# EAGLE schematic untitled (EAGLE 9.6.2)
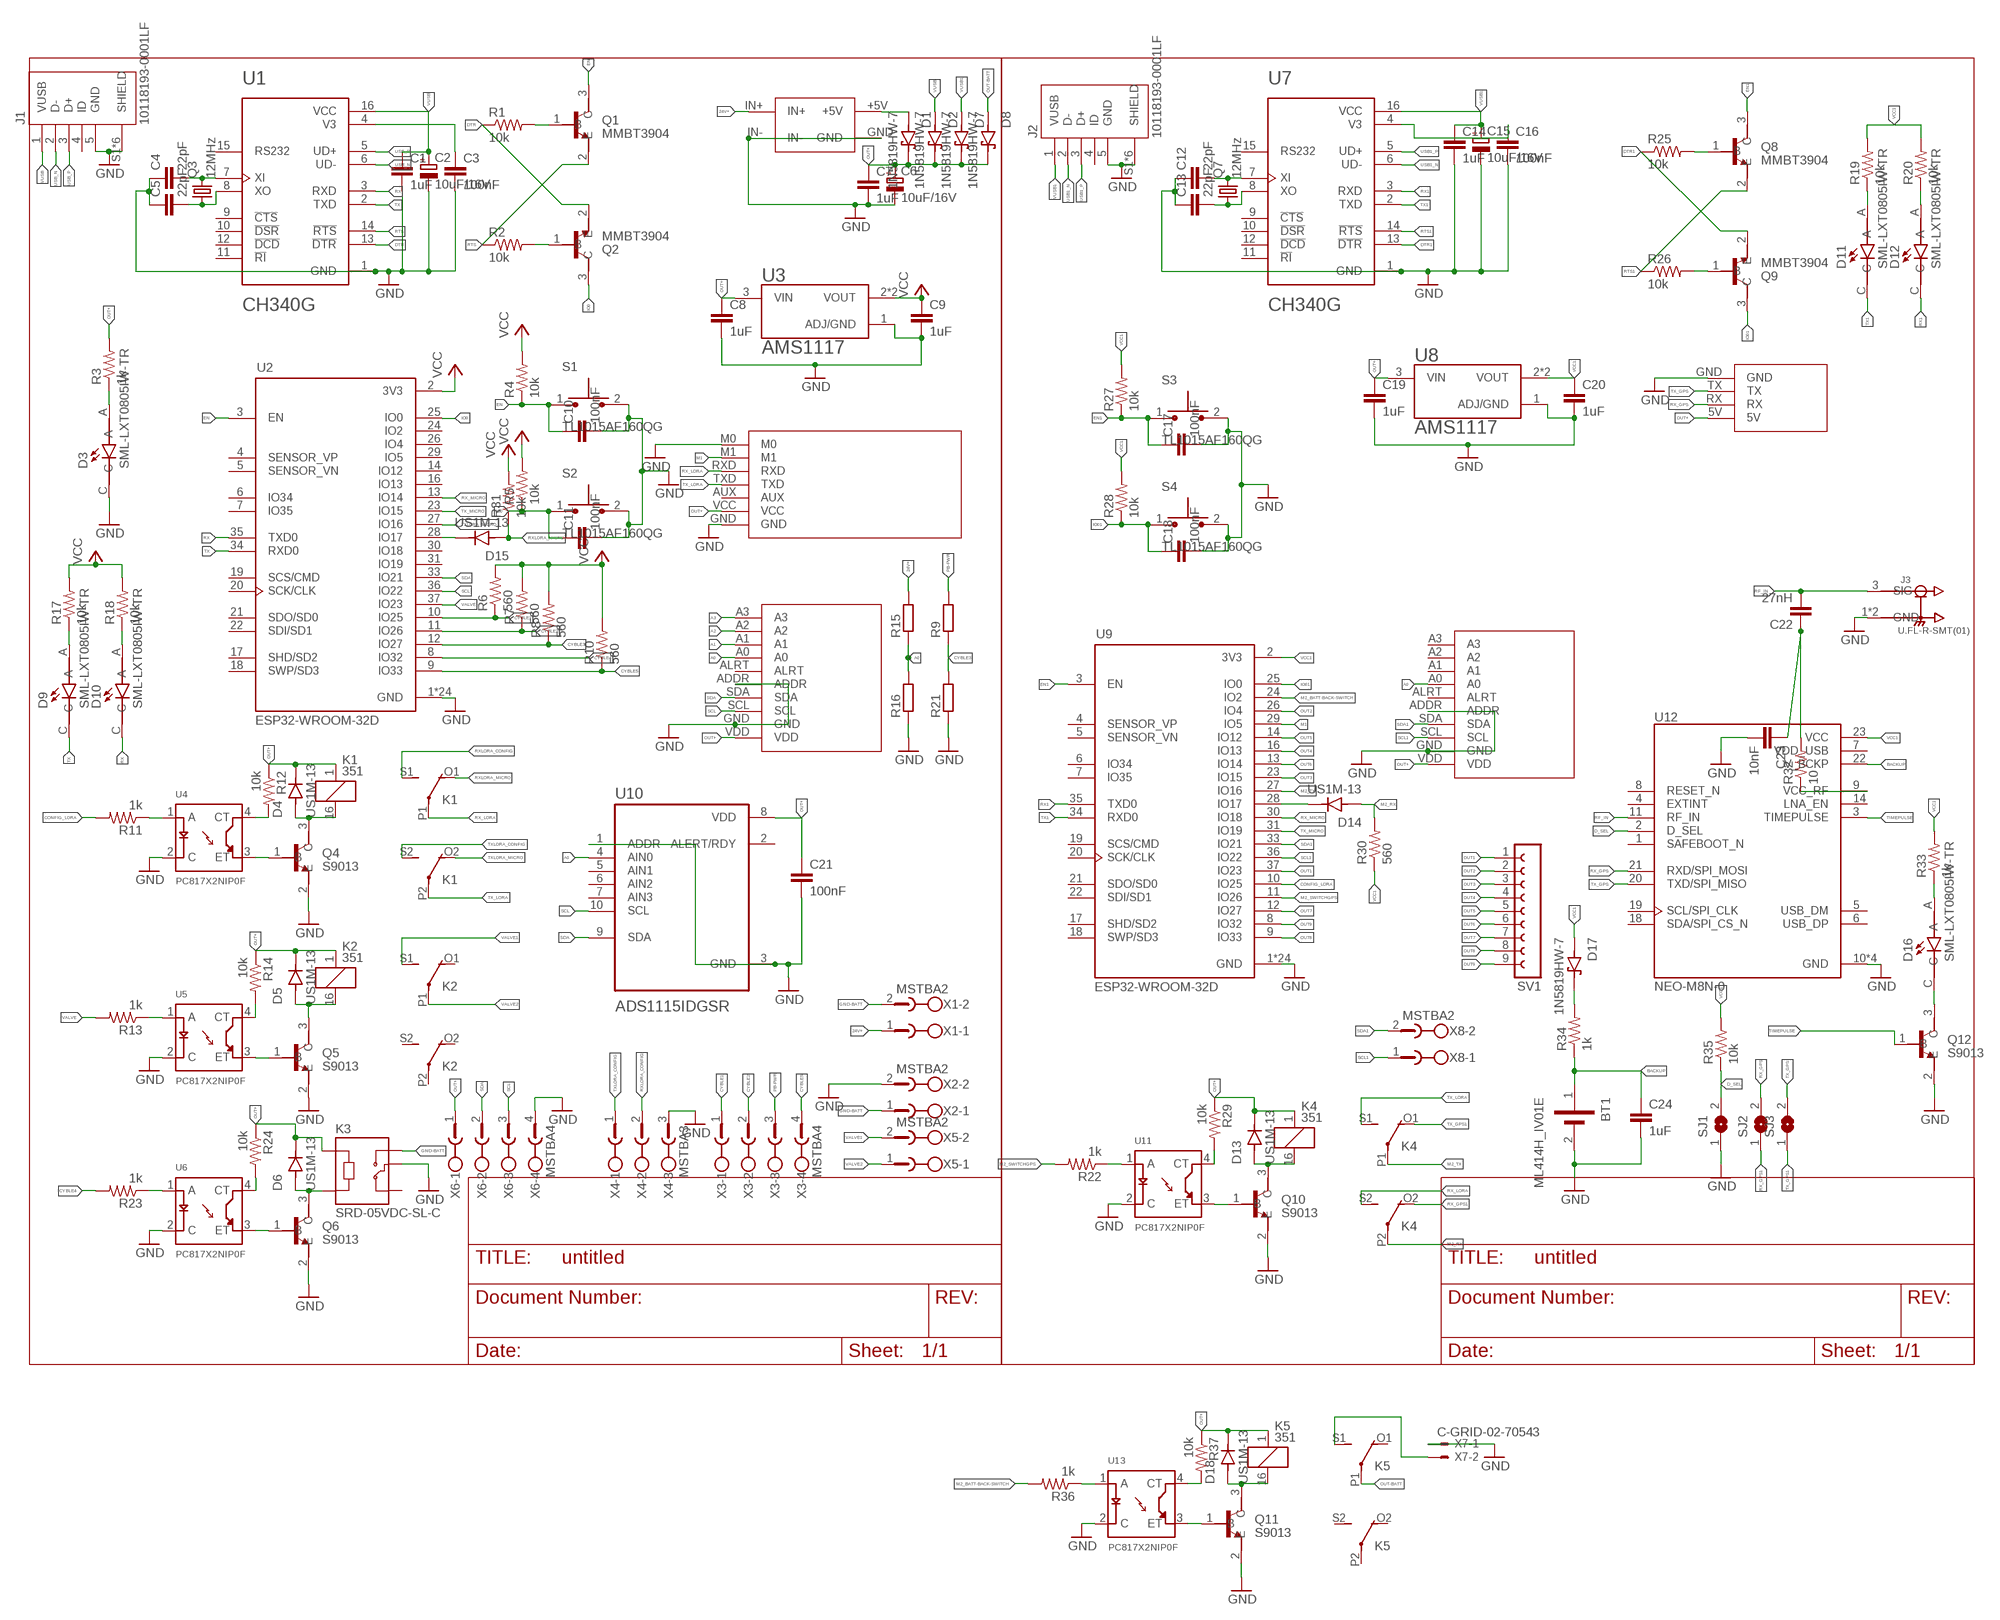
[diagram p0: schematic, sheet 1]

## Parts
ADS1  ADS1115  [ADS1115]
ADS2  ADS1115  [ADS1115]
BT1  ML414H_IV01E  [SEIKO_ML414H_IV01E]
C1  1uF  C-EUC0805K  [C0805K]
C2  10uF/16V  CPOL-EU153CLV-0505  [153CLV-0505]
C3  100nF  C-EUC0805K  [C0805K]
C4  22pF  C-EUC0805K  [C0805K]
C5  22pF  C-EUC0805K  [C0805K]
C6  10uF/16V  CPOL-EU153CLV-0505  [153CLV-0505]
C7  1uF  C-EUC0805K  [C0805K]
C8  1uF  C-EUC0805K  [C0805K]
C9  1uF  C-EUC0805K  [C0805K]
C10  100nF  C-EUC0805K  [C0805K]
C11  100nF  C-EUC0805K  [C0805K]
C12  22pF  C-EUC0805K  [C0805K]
C13  22pF  C-EUC0805K  [C0805K]
C14  1uF  C-EUC0805K  [C0805K]
C15  10uF/16V  CPOL-EU153CLV-0505  [153CLV-0505]
C16  100nF  C-EUC0805K  [C0805K]
C17  100nF  C-EUC0805K  [C0805K]
C18  100nF  C-EUC0805K  [C0805K]
C19  1uF  C-EUC0805K  [C0805K]
C20  1uF  C-EUC0805K  [C0805K]
C21  100nF  C-EUC0805K  [C0805K]
C22  27nH  C-EUC0805K  [C0805K]
C23  10nF  C-EUC0805K  [C0805K]
C24  1uF  C-EUC0805K  [C0805K]
D1  1N5819HW-7  [SOD3715X145N]
D2  1N5819HW-7  [SOD3715X145N]
D3  SML-LXT0805IW-TR  [LEDC2012X120N]
D4  US1M-13  [DIOM5226X240N]
D5  US1M-13  [DIOM5226X240N]
D6  US1M-13  [DIOM5226X240N]
D7  1N5819HW-7  [SOD3715X145N]
D8  1N5819HW-7  [SOD3715X145N]
D9  SML-LXT0805IW-TR  [LEDC2012X120N]
D10  SML-LXT0805IW-TR  [LEDC2012X120N]
D11  SML-LXT0805IW-TR  [LEDC2012X120N]
D12  SML-LXT0805IW-TR  [LEDC2012X120N]
D13  US1M-13  [DIOM5226X240N]
D14  US1M-13  [DIOM5226X240N]
D15  US1M-13  [DIOM5226X240N]
D16  SML-LXT0805IW-TR  [LEDC2012X120N]
D17  1N5819HW-7  [SOD3715X145N]
D18  US1M-13  [DIOM5226X240N]
EBYTEE220-900T22D1  EBYTEE220-900T22D  [EBYTEE220-900T22D]
J1  10118193-0001LF  [FCI_10118193-0001LF]
J2  10118193-0001LF  [FCI_10118193-0001LF]
J3  U.FL-R-SMT(01)  [HRS_U.FL-R-SMT(01)]
K1  351  [351]
K2  351  [351]
K3  SRD-05VDC-SL-C  [RELAY_SRD-05VDC-SL-C]
K4  351  [351]
K5  351  [351]
NEO-6MGPS1  NEO-6MGPS  [NEO-6MGPS]
Q1  MMBT3904  [SOT95P240X120-3N]
Q2  MMBT3904  [SOT95P240X120-3N]
Q3  12MHz  CRYSTALSM49  [SM49]
Q4  S9013  [SOT95P240X120-3N]
Q5  S9013  [SOT95P240X120-3N]
Q6  S9013  [SOT95P240X120-3N]
Q7  12MHz  CRYSTALSM49  [SM49]
Q8  MMBT3904  [SOT95P240X120-3N]
Q9  MMBT3904  [SOT95P240X120-3N]
Q10  S9013  [SOT95P240X120-3N]
Q11  S9013  [SOT95P240X120-3N]
Q12  S9013  [SOT95P240X120-3N]
R1  10k  R-US_M0805  [M0805]
R2  10k  R-US_M0805  [M0805]
R3  1k  R-US_M0805  [M0805]
R4  10k  R-US_M0805  [M0805]
R5  10k  R-US_M0805  [M0805]
R6  560  R-US_M0805  [M0805]
R7  560  R-US_M0805  [M0805]
R8  560  R-US_M0805  [M0805]
R9  R-EU_0207/12  [0207/12]
R10  560  R-US_M0805  [M0805]
R11  1k  R-US_M0805  [M0805]
R12  10k  R-US_M0805  [M0805]
R13  1k  R-US_M0805  [M0805]
R14  10k  R-US_M0805  [M0805]
R15  R-EU_0207/12  [0207/12]
R16  R-EU_0207/12  [0207/12]
R17  10k  R-US_M0805  [M0805]
R18  10k  R-US_M0805  [M0805]
R19  10k  R-US_M0805  [M0805]
R20  10k  R-US_M0805  [M0805]
R21  R-EU_0207/12  [0207/12]
R22  1k  R-US_M0805  [M0805]
R23  1k  R-US_M0805  [M0805]
R24  10k  R-US_M0805  [M0805]
R25  10k  R-US_M0805  [M0805]
R26  10k  R-US_M0805  [M0805]
R27  10k  R-US_M0805  [M0805]
R28  10k  R-US_M0805  [M0805]
R29  10k  R-US_M0805  [M0805]
R30  560  R-US_M0805  [M0805]
R31  10k  R-US_M0805  [M0805]
R32  10  R-US_M0805  [M0805]
R33  1k  R-US_M0805  [M0805]
R34  1k  R-US_M0805  [M0805]
R35  10k  R-US_M0805  [M0805]
R36  1k  R-US_M0805  [M0805]
R37  10k  R-US_M0805  [M0805]
S1  TL1015AF160QG  [SW_TL1015AF160QG]
S2  TL1015AF160QG  [SW_TL1015AF160QG]
S3  TL1015AF160QG  [SW_TL1015AF160QG]
S4  TL1015AF160QG  [SW_TL1015AF160QG]
SJ1  SJ  [SJ]
SJ2  SJ  [SJ]
SJ3  SJ  [SJ]
SUPER-STEPDOWN1  SUPER-STEPDOWN  [SUPER-STEPDOWN]
SV1  FE09-1  [FE09]
U1  CH340G  [SOIC127P600X180-16N]
U2  ESP32-WROOM-32D  [MODULE_ESP32-WROOM-32D]
U3  AMS1117  [SOT229P700X180-4N]
U4  PC817X2NIP0F  [SOT254P975X400-4N]
U5  PC817X2NIP0F  [SOT254P975X400-4N]
U6  PC817X2NIP0F  [SOT254P975X400-4N]
U7  CH340G  [SOIC127P600X180-16N]
U8  AMS1117  [SOT229P700X180-4N]
U9  ESP32-WROOM-32D  [MODULE_ESP32-WROOM-32D]
U10  ADS1115IDGSR  [SOP50P490X110-10N]
U11  PC817X2NIP0F  [SOT254P975X400-4N]
U12  NEO-M8N-0  [XCVR_NEO-M8N-0]
U13  PC817X2NIP0F  [SOT254P975X400-4N]
X1  MSTBA2  [MSTBA2]
X2  MSTBA2  [MSTBA2]
X3  MSTBA4  [MSTBA4]
X4  MSTBA3  [MSTBA3]
X5  MSTBA2  [MSTBA2]
X6  MSTBA4  [MSTBA4]
X7  C-GRID-02-70543  [70543-02]
X8  MSTBA2  [MSTBA2]

## Nets
24V+: R15.2 SUPER-STEPDOWN1.IN+ X1.1
A0: ADS1.A0 ADS2.A0 R15.1 R16.2 U10.4(AIN0)
A1: ADS1.A1
A2: ADS1.A2
A3: ADS1.A3
BACKUP: BT1.1(POS) C24.1 R34.1 U12.22(V_BCKP)
CONFIG_LORA: R11.2 U9.10(IO25)
CYBLE1: R6.1 U2.10(IO25) X3.1
CYBLE2: R7.1 U2.11(IO26) X3.2
CYBLE3: R8.1 R9.1 R21.2 U2.12(IO27)
CYBLE4: R23.2 U2.8(IO32)
CYBLE5: R10.1 U2.9(IO33) X3.4
D_SEL: R35.1 SJ1.2 U12.2(D_SEL)
DTR: Q2.2(E) R1.1 U1.13(!DTR)
DTR1: Q9.2(E) R25.1 U7.13(!DTR)
EN: C10.1 Q1.3(C) R4.1 S1.1 U2.3(EN)
EN1: C17.1 Q8.3(C) R27.1 S3.1 U9.3(EN)
GND: ADS1.ADDR ADS1.GND ADS2.ADDR ADS2.GND BT1.2(NEG) C1.2 C2.- C3.2 C4.1 C5.1 C6.- C7.2 C8.2 C9.2 C10.2 C11.2 C12.1 C13.1 C14.2 C15.- C16.2 C17.2 C18.2 C19.2 C20.2 C21.2 C23.2 C24.2 D3.C EBYTEE220-900T22D1.GND EBYTEE220-900T22D1.M0 J1.5(GND) J1.S1(SHIELD) J1.S2(SHIELD) J1.S3(SHIELD) J1.S4(SHIELD) J1.S5(SHIELD) J1.S6(SHIELD) J2.5(GND) J2.S1(SHIELD) J2.S2(SHIELD) J2.S3(SHIELD) J2.S4(SHIELD) J2.S5(SHIELD) J2.S6(SHIELD) J3.1(GND) J3.2(GND) K3.COM NEO-6MGPS1.GND Q4.2(E) Q5.2(E) Q6.2(E) Q10.2(E) Q11.2(E) Q12.2(E) R16.1 R21.1 S1.2 S2.2 S3.2 S4.2 SJ1.1 SUPER-STEPDOWN1.GND SUPER-STEPDOWN1.IN- U1.1(GND) U2.1(GND) U2.15(GND) U2.38(GND) U2.39_1(GND) U2.39_2(GND) U2.39_3(GND) U2.39_4(GND) U2.39_5(GND) U2.39_6(GND) U2.39_7(GND) U2.39_8(GND) U2.39_9(GND) U2.39_10(GND) U2.39_11(GND) U2.39_12(GND) U2.39_13(GND) U2.39_14(GND) U2.39_15(GND) U2.39_16(GND) U2.39_17(GND) U2.39_18(GND) U2.39_19(GND) U2.39_20(GND) U2.39_21(GND) U3.1(ADJ/GND) U4.2(C) U5.2(C) U6.2(C) U7.1(GND) U8.1(ADJ/GND) U9.1(GND) U9.15(GND) U9.38(GND) U9.39_1(GND) U9.39_2(GND) U9.39_3(GND) U9.39_4(GND) U9.39_5(GND) U9.39_6(GND) U9.39_7(GND) U9.39_8(GND) U9.39_9(GND) U9.39_10(GND) U9.39_11(GND) U9.39_12(GND) U9.39_13(GND) U9.39_14(GND) U9.39_15(GND) U9.39_16(GND) U9.39_17(GND) U9.39_18(GND) U9.39_19(GND) U9.39_20(GND) U9.39_21(GND) U10.1(ADDR) U10.3(GND) U11.2(C) U12.10(GND) U12.12(GND) U12.13(GND) U12.24(GND) U13.2(C) X2.2 X4.3 X6.4 X7.1
GND-BATT: K3.NO X1.2 X2.1
IO0: C11.1 Q2.3(C) R5.1 S2.1 U2.25(IO0)
IO01: C18.1 Q9.3(C) R28.1 S4.1 U9.25(IO0)
M1: EBYTEE220-900T22D1.M1 U9.29(IO5)
M2_BATT-BACK-SWITCH: R36.2 U9.24(IO2)
M2_RX: D14.A K4.P2(3:P) R30.2
M2_SWITCHGPS: R22.2 U9.11(IO26)
M2_TX: K4.P1(2:P) U9.27(IO16)
N$1: C4.2 Q3.2 U1.7(XI)
N$2: C5.2 Q3.1 U1.8(XO)
N$3: Q1.1(B) R1.2
N$4: Q8.1(B) R25.2
N$5: C3.1 U1.4(V3)
N$6: D3.A R3.1
N$7: D1.A SUPER-STEPDOWN1.+5V
N$8: Q2.1(B) R2.2
N$9: R11.1 U4.1(A)
N$10: R12.2 U4.4(CT)
N$11: R13.1 U5.1(A)
N$12: D4.A K1.16 Q4.3(C)
N$13: Q4.1(B) U4.3(ET)
N$14: R14.2 U5.4(CT)
N$15: D5.A K2.16 Q5.3(C)
N$16: Q9.1(B) R26.2
N$17: Q5.1(B) U5.3(ET)
N$18: D9.A R17.1
N$19: R24.2 U6.4(CT)
N$20: D6.A K3.A2 Q6.3(C)
N$21: D10.A R18.1
N$22: D11.A R19.1
N$23: D12.A R20.1
N$24: Q6.1(B) U6.3(ET)
N$25: R23.1 U6.1(A)
N$26: C16.1 U7.4(V3)
N$27: C13.2 Q7.1 U7.8(XO)
N$28: C12.2 Q7.2 U7.7(XI)
N$29: R36.1 U13.1(A)
N$30: R22.1 U11.1(A)
N$31: Q10.1(B) U11.3(ET)
N$32: R29.2 U11.4(CT)
N$33: D13.A K4.16 Q10.3(C)
N$34: D14.C(K) U9.28(IO17)
N$35: D15.C(K) U2.28(IO17)
N$36: C22.1 C23.1 R32.2
N$37: R32.1 U12.9(VCC_RF)
N$38: D16.C Q12.3(C)
N$39: D16.A R33.1
N$40: R37.2 U13.4(CT)
N$41: D17.C(K) R34.2
N$42: D18.A K5.16 Q11.3(C)
N$43: Q11.1(B) U13.3(ET)
N$44: K5.S1(2:S) X7.2
OUT1: SV1.1 U9.37(IO23)
OUT2: SV1.2 U9.26(IO4)
OUT3: SV1.3 U9.23(IO15)
OUT4: SV1.4 U9.16(IO13)
OUT5: SV1.5 U9.14(IO12)
OUT6: SV1.6 U9.13(IO14)
OUT7: SV1.7 U9.12(IO27)
OUT8: SV1.8 U9.9(IO33)
OUT9: SV1.9 U9.8(IO32)
OUT+: ADS1.VDD ADS2.VDD C6.+ C7.1 C8.1 C19.1 C21.1 D1.C(K) D2.C(K) D4.C(K) D5.C(K) D6.C(K) D7.C(K) D8.C(K) D13.C(K) D18.C(K) EBYTEE220-900T22D1.VCC K1.1 K2.1 K3.A1 K4.1 K5.1 NEO-6MGPS1.5V R3.2 R12.1 R14.1 R24.1 R29.1 R37.1 U3.3(VIN) U8.3(VIN) U10.8(VDD) X6.1
OUT-BATT: D8.A K5.P1(2:P)
PB-PWR: R9.2 X3.3
RF_IN: C22.2 J3.3(SIG) U12.11(RF_IN)
RTS: Q1.2(E) R2.1 U1.14(!RTS)
RTS1: Q8.2(E) R26.1 U7.14(!RTS)
RX: D10.C U1.3(RXD) U2.35(TXD0)
RX1: D12.C U7.3(RXD) U9.35(TXD0)
RX_GPS: NEO-6MGPS1.RX SJ2.2 U12.21(RXD/SPI_MOSI)
RX_GPS1: K4.O2(3:O) SJ2.1
RX_LORA: EBYTEE220-900T22D1.RXD K1.P1(2:P) K4.S2(3:S)
RX_MICRO: U2.13(IO14) U9.30(IO18)
RXLORA_CONFIG: K1.S1(2:S) X4.2
RXLORA_MICRO: D15.A K1.O1(2:O) R31.1
SCL: ADS1.SCL U2.36(IO22) U10.10(SCL) X6.3
SCL1: ADS2.SCL U9.36(IO22) X8.1
SDA: ADS1.SDA U2.33(IO21) U10.9(SDA) X6.2
SDA1: ADS2.SDA U9.33(IO21) X8.2
TIMEPULSE: Q12.1(B) U12.3(TIMEPULSE)
TX: D9.C U1.2(TXD) U2.34(RXD0)
TX1: D11.C U7.2(TXD) U9.34(RXD0)
TX_GPS: NEO-6MGPS1.TX SJ3.2 U12.20(TXD/SPI_MISO)
TX_GPS1: K4.O1(2:O) SJ3.1
TX_LORA: EBYTEE220-900T22D1.TXD K1.P2(3:P) K4.S1(2:S)
TX_MICRO: U2.23(IO15) U9.31(IO19)
TXLORA_CONFIG: K1.S2(3:S) X4.1
TXLORA_MICRO: K1.O2(3:O) U2.27(IO16)
USB1_N: J2.2(D-) U7.6(UD-)
USB1_P: J2.3(D+) U7.5(UD+)
USB_N: J1.2(D-) U1.6(UD-)
USB_P: J1.3(D+) U1.5(UD+)
VALVE: R13.2 U2.37(IO23)
VALVE1: K2.S1(2:S) X5.2
VALVE2: K2.P1(2:P) X5.1
VCC: C9.1 R4.2 R5.2 R6.2 R7.2 R8.2 R10.2 R17.2 R18.2 R31.2 U2.2(3V3) U3.2(VOUT) U3.4(VOUT)
VCC1: C20.1 D17.A R19.2 R20.2 R27.2 R28.2 R30.1 R33.2 R35.2 U8.2(VOUT) U8.4(VOUT) U9.2(3V3) U12.23(VCC)
VUSB: C1.1 C2.+ D2.A J1.1(VUSB) U1.16(VCC)
VUSB1: C14.1 C15.+ D7.A J2.1(VUSB) U7.16(VCC)
Unconnected: ADS1.ALRT ADS2.A1 ADS2.A2 ADS2.A3 ADS2.ALRT EBYTEE220-900T22D1.AUX J1.4(ID) J2.4(ID) K2.O1(2:O) K2.O2(3:O) K2.P2(3:P) K2.S2(3:S) K3.NC K5.O1(2:O) K5.O2(3:O) K5.P2(3:P) K5.S2(3:S) U1.9(!CTS) U1.10(!DSR) U1.11(!RI) U1.12(!DCD) U1.15(RS232) U2.4(SENSOR_VP) U2.5(SENSOR_VN) U2.6(IO34) U2.7(IO35) U2.14(IO12) U2.16(IO13) U2.17(SHD/SD2) U2.18(SWP/SD3) U2.19(SCS/CMD) U2.20(SCK/CLK) U2.21(SDO/SD0) U2.22(SDI/SD1) U2.24(IO2) U2.26(IO4) U2.29(IO5) U2.30(IO18) U2.31(IO19) U7.9(!CTS) U7.10(!DSR) U7.11(!RI) U7.12(!DCD) U7.15(RS232) U9.4(SENSOR_VP) U9.5(SENSOR_VN) U9.6(IO34) U9.7(IO35) U9.17(SHD/SD2) U9.18(SWP/SD3) U9.19(SCS/CMD) U9.20(SCK/CLK) U9.21(SDO/SD0) U9.22(SDI/SD1) U10.2(ALERT/RDY) U10.5(AIN1) U10.6(AIN2) U10.7(AIN3) U12.1(SAFEBOOT_N) U12.4(EXTINT) U12.5(USB_DM) U12.6(USB_DP) U12.8(RESET_N) U12.14(LNA_EN) U12.18(SDA/SPI_CS_N) U12.19(SCL/SPI_CLK)

## Power pins joined to a net without a drawn wire
VDD_USB: U12.7(VDD_USB)

## Library data of the parts
ADS1 ADS2 = ds1115:ADS1115
BT1 = ML414H_IV01E:ML414H_IV01E: Coin 3V 0.001Ah Secondary Check availability <https://pricing.snapeda.com/parts/ML414H%20IV01E/Seiko%20Instruments/view-part?ref=eda>; AVAILABILITY: In Stock; DESCRIPTION: Coin, 4.8mm 3 V Lithium Battery Rechargeable (Secondary) 1mAh; MF: Seiko Instruments; MP: ML414H IV01E; PACKAGE: SOT-89 Seiko; PRICE: None; PURCHASE-URL: https://pricing.snapeda.com/search?q=ML414H IV01E&ref=eda
C1 C3-C5 C7-C14 C16-C24 = rcl:C-EU: CAPACITOR, European symbol; SPICEPREFIX: C
C2 C6 C15 = rcl:CPOL-EU: POLARIZED CAPACITOR, European symbol; SPICEPREFIX: C
D1 D2 D7 D8 D17 = 1N5819HW-7:1N5819HW-7: 1N5819HW Series 40 V 1 A Surface Mount Schottky Barrier Rectifier - SOD-123 Check availability <https://pricing.snapeda.com/parts/1N5819HW-7/Diodes%20Inc./view-part?ref=eda>; AVAILABILITY: In Stock; DESCRIPTION: Diode Schottky 40 V 1A Surface Mount SOD-123; MF: Diodes Inc.; MP: 1N5819HW-7; PACKAGE: SOD-123 Fairchild Semiconductor; PRICE: None; PURCHASE-URL: https://pricing.snapeda.com/search/part/1N5819HW-7/?ref=eda
D3 D9-D12 D16 = SML-LXT0805IW-TR:SML-LXT0805IW-TR: LED; Luminous Intensity:11µcd; Viewing Angle:140°; Forward Current:30mA; Forward Voltage:2V; Color:Red; LED Color:Red; Leaded Process Compatible:Yes; Lens Color:White; Mounting Type:Surface Mount ;RoHS Compliant: Yes Check availability <https://pricing.snapeda.com/parts/SML-LXT0805IW-TR/Lumex%20Opto/Components/view-part?ref=eda>; AVAILABILITY: In Stock; DESCRIPTION: Red - LED Indication - Discrete 2V 0805 (2012 Metric); MF: Lumex Opto/Components; MP: SML-LXT0805IW-TR; PACKAGE: 0805 Lumex; PRICE: None; PURCHASE-URL: https://pricing.snapeda.com/search/part/SML-LXT0805IW-TR/?ref=eda
D4-D6 D13-D15 D18 = US1M-13:US1M-13: Diode, Fast Recovery, 1a, 1kv, Do-214ac-2, Full Reel Check availability <https://pricing.snapeda.com/parts/US1M-13/Diodes%20Incorporated/view-part?ref=eda>; AVAILABILITY: In Stock; DESCRIPTION: Diode Standard 1000 V 1A Surface Mount SMA; MF: Diodes Incorporated; MP: US1M-13; PACKAGE: DO-214AC-214 Diodes Incorporated; PRICE: None; PURCHASE-URL: https://pricing.snapeda.com/search/part/US1M-13/?ref=eda
EBYTEE220-900T22D1 = EByte E220-900T22D:EBYTEE220-900T22D
J1 J2 = 10118193-0001LF:10118193-0001LF: Micro USB B Type Receptacle Check availability <https://pricing.snapeda.com/parts/10118193-0001LF/FCI/view-part?ref=eda>; AVAILABILITY: In Stock; DESCRIPTION: USB - micro B USB 2.0 Receptacle Connector 5 Position Surface Mount, Right Angle; Through Hole; MF: FCI; MP: 10118193-0001LF; PACKAGE: None; PRICE: None; PURCHASE-URL: https://pricing.snapeda.com/search/part/10118193-0001LF/?ref=eda
J3 = U.FL-R-SMT_01_:U.FL-R-SMT(01): U.FL Series 6 Ghz 50 Ohm Ultra-small SMT Coaxial Cable Receptacle Check availability <https://pricing.snapeda.com/parts/U.FL-R-SMT%2801%29/Hirose/view-part?ref=eda>; AVAILABILITY: In Stock; DESCRIPTION: U.FL (UMCC) Connector Receptacle, Male Pin 50Ohm Surface Mount Solder. RF Connectors / Coaxial Connectors; MF: Hirose; MP: U.FL-R-SMT(01); PACKAGE: None; PRICE: None; PURCHASE-URL: https://pricing.snapeda.com/search/part/U.FL-R-SMT(01)/?ref=eda
K1 K2 K4 K5 = relay:351: RELAY 2 x switch, Omron; OC_FARNELL: unknown; OC_NEWARK: unknown
K3 = SRD-05VDC-SL-C:SRD-05VDC-SL-C: 5V Trigger Relay Module For Arduino And Raspberry Pi 5V Trigger Relay Module For Arduino And Raspberry Pi Check availability <https://pricing.snapeda.com/parts/SRD-05VDC-SL-C/Songle%20Relay/view-part?ref=eda>; AVAILABILITY: Not in stock; DESCRIPTION: 5V Trigger Relay Module For Arduino And Raspberry Pi 5V Trigger Relay Module For Arduino And Raspberry Pi; MF: Songle Relay; MP: SRD-05VDC-SL-C; PACKAGE: NON STANDARD-5 Songle Relay; PRICE: None
NEO-6MGPS1 = NEO-6M GPS:NEO-6MGPS
Q1 Q2 Q8 Q9 = MMBT3904:MMBT3904: MMBT3904 Series 40 V CE Breakdown 0.2 A NPN General Purpose Amplifier - SOT-23 Check availability <https://pricing.snapeda.com/parts/MMBT3904/ON%20Semiconductor/view-part?ref=eda>; AVAILABILITY: In Stock; DESCRIPTION: Bipolar (BJT) Transistor NPN 40 V 200 mA 300MHz 300 mW Surface Mount SOT-23-3 (TO-236); MF: ON Semiconductor; MP: MMBT3904; PACKAGE: SOT-23-3 Motorola; PRICE: None
Q3 Q7 = crystal:CRYSTAL: CRYSTAL; OC_FARNELL: unknown; OC_NEWARK: unknown
Q4-Q6 Q10-Q12 = S9013:S9013: SMD Transistors NPN 25V-500mA Check availability <https://pricing.snapeda.com/parts/S9013/JCET/view-part?ref=eda>; AVAILABILITY: In Stock; DESCRIPTION: Bipolar (BJT) Transistor NPN 20V 500mA 625mW Through Hole TO-92-3; MF: JCET; MP: S9013; PACKAGE: SOT-23-3 JCET; PRICE: None; PURCHASE-URL: https://pricing.snapeda.com/search/part/S9013/?ref=eda
R1-R8 R10-R14 R17-R20 R22-R37 = rcl:R-US_: RESISTOR, American symbol; SPICEPREFIX: R
R9 R15 R16 R21 = rcl:R-EU_: RESISTOR, European symbol; SPICEPREFIX: R
S1-S4 = TL1015AF160QG:TL1015AF160QG: Tactile Switch SPST-NO Top Actuated Surface Mount Check availability <https://pricing.snapeda.com/parts/TL1015AF160QG/E-Switch/view-part?ref=eda>; AVAILABILITY: In Stock; DESCRIPTION: Tactile Switch SPST-NO Top Actuated Surface Mount; MF: E-Switch; MP: TL1015AF160QG; PACKAGE: None; PRICE: None; PURCHASE-URL: https://pricing.snapeda.com/search/part/TL1015AF160QG/?ref=eda
SJ1-SJ3 = jumper:SJ: SMD solder JUMPER
SUPER-STEPDOWN1 = SUPER-STEPDOWN:SUPER-STEPDOWN
SV1 = con-lsta:FE09-1: FEMALE HEADER; OC_FARNELL: unknown; OC_NEWARK: unknown
U1 U7 = CH340G:CH340G: Check availability <https://pricing.snapeda.com/parts/Ch340G/WCH/view-part?ref=eda>; AVAILABILITY: Not in stock; DESCRIPTION: USB Interface Integrated Circuit; MF: WCH; MP: Ch340G; PACKAGE: None; PRICE: None
U2 U9 = ESP32-WROOM-32D:ESP32-WROOM-32D: Bluetooth, WiFi 802.11b/g/n, Bluetooth v4.2 + EDR, Class 1, 2 and 3 Transceiver Module 2.4GHz ~ 2.5GHz Integrated, Trace Surface Mount Check availability <https://pricing.snapeda.com/parts/ESP32-WROOM-32D/Espressif%20Systems/view-part?ref=eda>; AVAILABILITY: In Stock; DESCRIPTION: Bluetooth, WiFi 802.11b/g/n, Bluetooth v4.2 +EDR, Class 1, 2 and 3 Transceiver Module 2.4GHz ~ 2.5GHz Integrated; MF: Espressif Systems; MP: ESP32-WROOM-32D; PACKAGE: Module Espressif Systems; PRICE: None; PURCHASE-URL: https://pricing.snapeda.com/search/part/ESP32-WROOM-32D/?ref=eda
U3 U8 = AMS1117:AMS1117: Sot223/Pkg 1-Amp 5-Volt Low Drop Out Voltage Regulatator Check availability <https://pricing.snapeda.com/parts/AMS1117/Advanced%20Monolithic%20Systems/view-part?ref=eda>; AVAILABILITY: Not in stock; DESCRIPTION: 1A LOW DROPOUT VOLTAGE REGULATOR SOT-223; MF: Advanced Monolithic Systems; MP: AMS1117; PACKAGE: SOT-223 Seeed Technology; PRICE: None
U4-U6 U11 U13 = PC817X2NIP0F:PC817X2NIP0F: PC817 Series 1 Channel 80 V 5000 Vrms General Purpose Photocoupler - DIP-4 Check availability <https://pricing.snapeda.com/parts/PC817X2NIP0F/Sharp%20Microelectronics/view-part?ref=eda>; AVAILABILITY: Not in stock; DESCRIPTION: Optoisolator Transistor Output 5000Vrms 1 Channel 4-SMD; MF: Sharp Microelectronics; MP: PC817X2NIP0F; PACKAGE: SMD-4 Sharp Microelectronics; PRICE: None
U10 = ADS1115IDGSR:ADS1115IDGSR: Check availability <https://pricing.snapeda.com/parts/ADS1115IDGSR/Texas%20Instruments/view-part?ref=eda>; AVAILABILITY: In Stock; DESCRIPTION: 16-bit, 860-SPS, 4-channel, delta-sigma ADC with PGA, oscillator, VREF, comparator and I2C; MF: Texas Instruments; MP: ADS1115IDGSR; PACKAGE: VSSOP-10 Texas Instruments; PRICE: None; PURCHASE-URL: https://pricing.snapeda.com/search/part/ADS1115IDGSR/?ref=eda
U12 = NEO-M8N-0:NEO-M8N-0: Ic Receiver Gps/Gnss 24lcc Check availability <https://pricing.snapeda.com/parts/NEO-M8N-0/U-Blox%20America/view-part?ref=eda>; AVAILABILITY: In Stock; DESCRIPTION: series RF Receiver BeiDou, Galileo, GLONASS, GNSS, GPS 1.575GHz -167dBm - - -; MF: U-Blox America; MP: NEO-M8N-0; PACKAGE: SMD-24 U-Blox America Inc.; PRICE: None; PURCHASE-URL: https://pricing.snapeda.com/search/part/NEO-M8N-0/?ref=eda
X1 X2 X5 X8 = con-phoenix-508:MSTBA2: PHOENIX; MF: FARNELL; MPN: 1757242; OC_FARNELL: 3705171; OC_NEWARK: 71C4161
X3 X6 = con-phoenix-508:MSTBA4: PHOENIX; MF: FARNELL; MPN: 1757268; OC_FARNELL: 3705195; OC_NEWARK: 71C4163
X4 = con-phoenix-508:MSTBA3: PHOENIX; MF: FARNELL; MPN: 1757255; OC_FARNELL: 3705183; OC_NEWARK: 71C4162
X7 = con-molex:C-GRID-02: CONNECTOR wire to board 2.54 mm (0.100") pitch header; MF: MOLEX; OC_FARNELL: unknown; OC_NEWARK: unknown